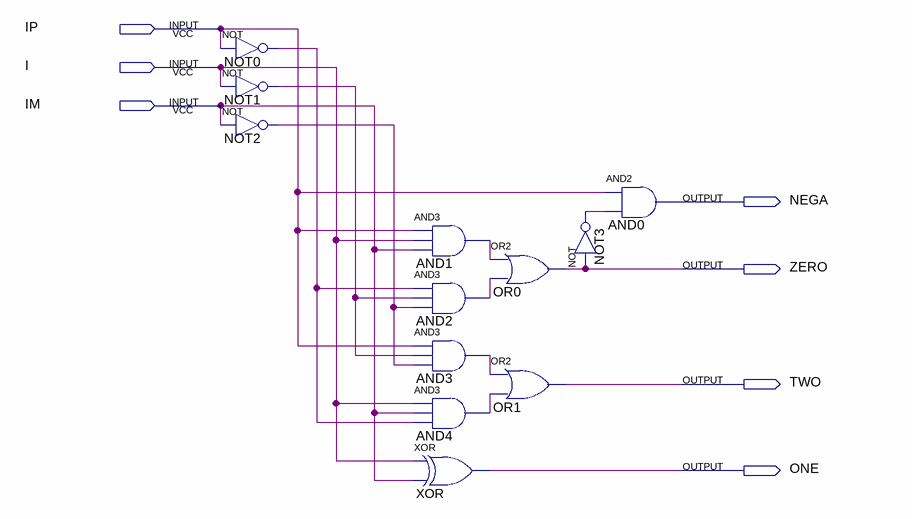
[diagram p0: schematic sheet]
// Quartus schematic B_ENC.bdf as structural Verilog: 12 symbols, 7 pins
module B_ENC (
  input  IP,
  input  I,
  input  IM,
  output NEGA,
  output ZERO,
  output TWO,
  output ONE
);

  wire AND1_out, AND2_out, AND3_out, AND4_out, NOT0_out, NOT1_out, NOT2_out, NOT3_out;

  not NOT0 (NOT0_out, IP);
  not NOT1 (NOT1_out, I);
  not NOT2 (NOT2_out, IM);
  and AND1 (AND1_out, IP, I, IM);
  and AND2 (AND2_out, NOT0_out, NOT1_out, NOT2_out);
  and AND3 (AND3_out, IP, NOT1_out, NOT2_out);
  and AND4 (AND4_out, I, IM, NOT0_out);
  xor XOR (ONE, I, IM);
  or OR0 (ZERO, AND1_out, AND2_out);
  or OR1 (TWO, AND3_out, AND4_out);
  not NOT3 (NOT3_out, ZERO);
  and AND0 (NEGA, IP, NOT3_out);
endmodule
